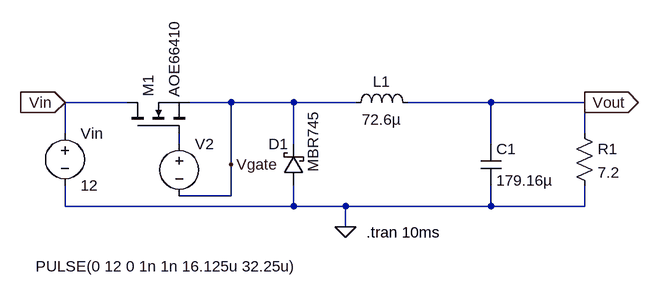
[diagram p0: schematic Buck Working open loop.asc]
Buck Working open loop.asc, the LTspice schematic file:
Version 4
SHEET 1 880 680
WIRE -176 240 -272 240
WIRE -16 240 -80 240
WIRE 80 240 -16 240
WIRE 176 240 80 240
WIRE 384 240 256 240
WIRE 528 240 384 240
WIRE -272 288 -272 240
WIRE 528 288 528 240
WIRE -96 304 -96 288
WIRE 80 304 80 240
WIRE 384 304 384 240
WIRE -16 336 -16 240
WIRE -16 384 -16 336
WIRE -16 384 -96 384
WIRE -272 400 -272 368
WIRE 80 400 80 368
WIRE 80 400 -272 400
WIRE 160 400 80 400
WIRE 384 400 384 368
WIRE 384 400 160 400
WIRE 528 400 528 368
WIRE 528 400 384 400
WIRE 160 432 160 400
FLAG 528 240 Vout
IOPIN 528 240 Out
FLAG -272 240 Vin
IOPIN -272 240 In
FLAG -16 336 Vgate
FLAG 160 432 0
SYMBOL voltage -272 272 R0
WINDOW 123 0 0 Left 0
WINDOW 39 0 0 Left 0
SYMATTR InstName Vin
SYMATTR Value 12
SYMBOL cap 368 304 R0
SYMATTR InstName C1
SYMATTR Value 179.16µ
SYMBOL ind 160 256 R270
WINDOW 0 32 56 VTop 2
WINDOW 3 5 56 VBottom 2
SYMATTR InstName L1
SYMATTR Value 72.6µ
SYMBOL schottky 96 368 R180
WINDOW 0 24 64 Left 2
WINDOW 3 -14 114 VLeft 2
SYMATTR InstName D1
SYMATTR Value MBR745
SYMATTR Description Diode
SYMATTR Type diode
SYMBOL nmos -176 288 R270
SYMATTR InstName M1
SYMATTR Value AOE66410
SYMBOL res 512 272 R0
SYMATTR InstName R1
SYMATTR Value 7.2
SYMBOL voltage -96 288 R0
WINDOW 3 -221 205 Left 2
WINDOW 123 0 0 Left 0
WINDOW 39 0 0 Left 0
SYMATTR Value PULSE(0 12 0 1n 1n 16.125u 32.25u)
SYMATTR InstName V2
TEXT 192 440 Left 2 !.tran 10ms

The netlist it stands for:
* Buck Working open loop.asc
Vin Vin 0 12
C1 Vout 0 179.16µ
L1 Vgate Vout 72.6µ
D1 0 Vgate MBR745
M1 Vin N001 Vgate Vgate AOE66410
R1 Vout 0 7.2
V2 N001 Vgate PULSE(0 12 0 1n 1n 16.125u 32.25u)
.model D D
.lib standard.dio
.model NMOS NMOS
.model PMOS PMOS
.lib standard.mos
.tran 10ms
.backanno
.end